# EAGLE design Graka (EAGLE 4.09)
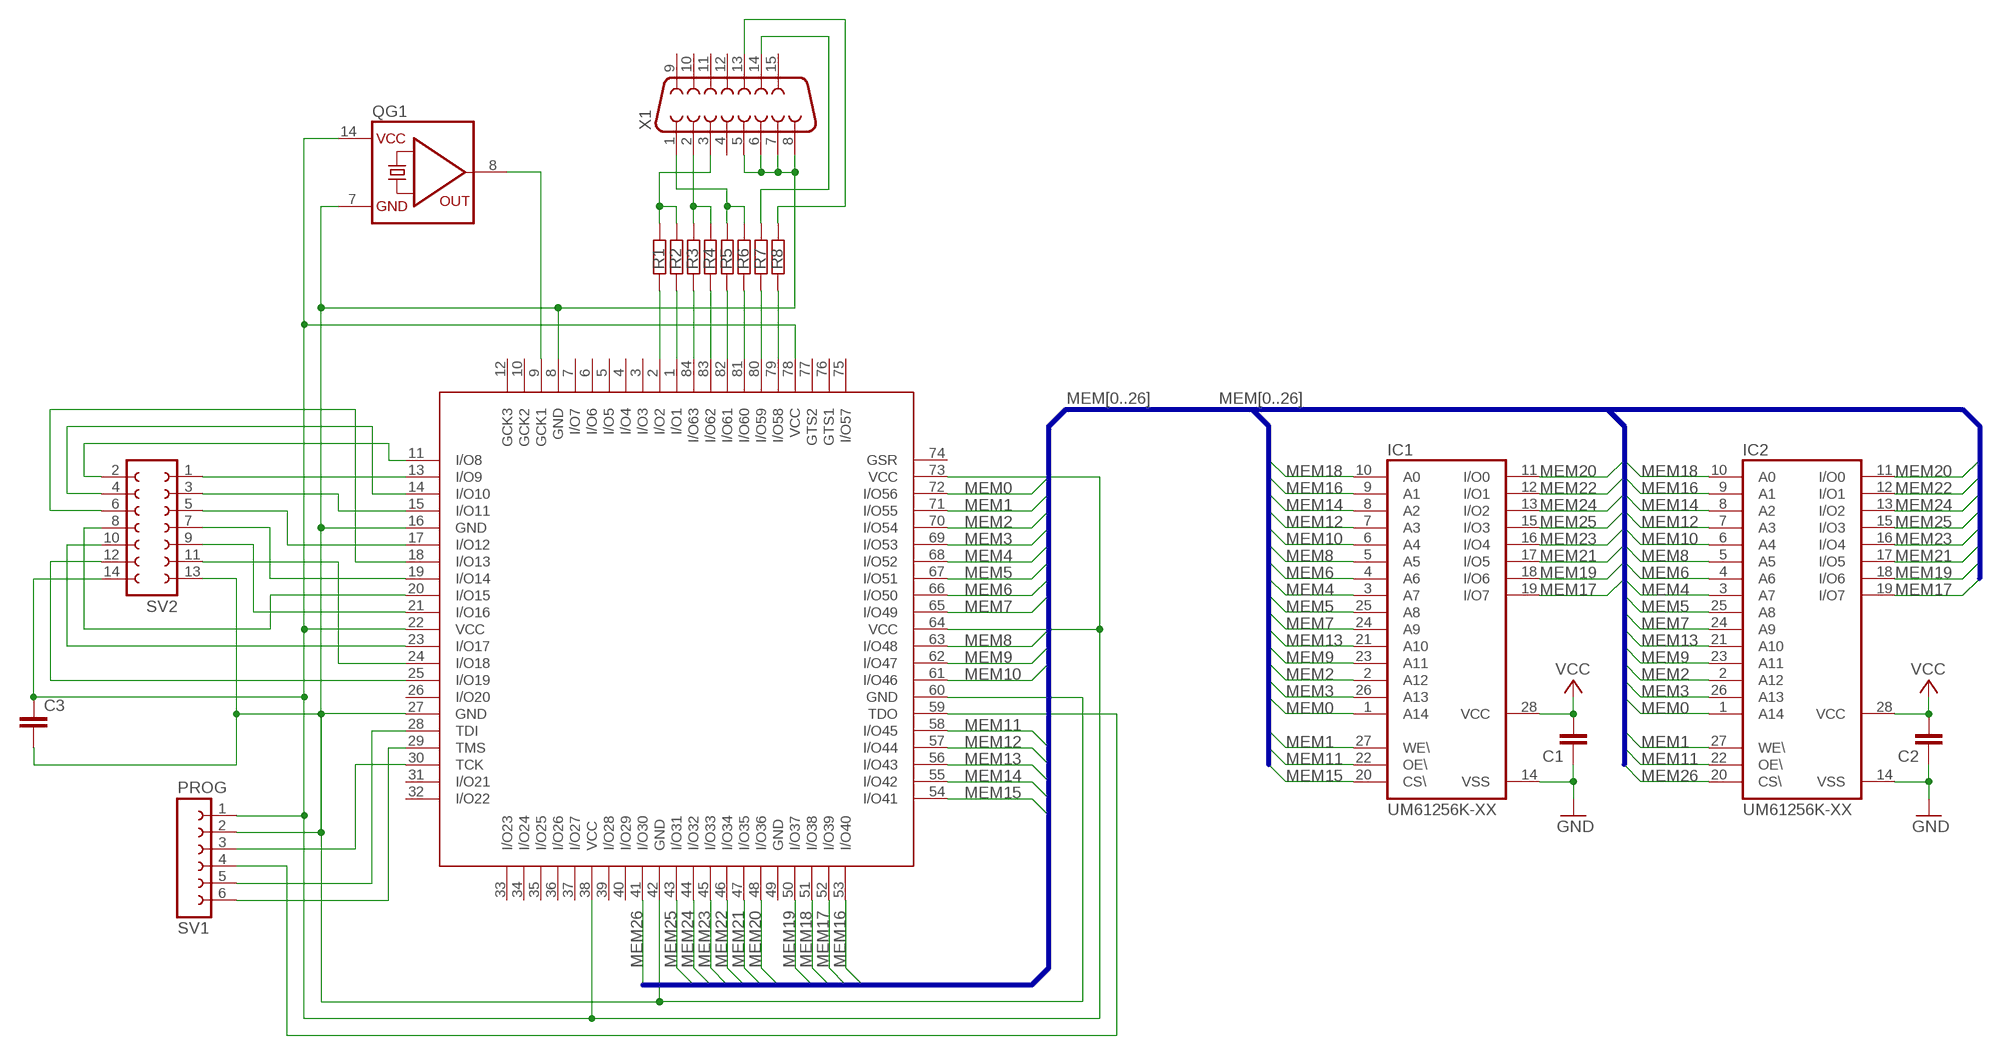
[diagram p0: schematic, sheet 1]

## Parts
C1  C-EU050-025X075  [C050-025X075]
C2  C-EU050-025X075  [C050-025X075]
C3  C-EU050-025X075  [C050-025X075]
IC1  UM61256K-XX  [DIP28_3]
IC2  UM61256K-XX  [DIP28_3]
QG1  QG5860  [DIL14S]
R1  R-EU_0207/10  [0207/10]
R2  R-EU_0207/10  [0207/10]
R3  R-EU_0207/10  [0207/10]
R4  R-EU_0207/10  [0207/10]
R5  R-EU_0207/10  [0207/10]
R6  R-EU_0207/10  [0207/10]
R7  R-EU_0207/10  [0207/10]
R8  R-EU_0207/10  [0207/10]
SV1  PROG  FE06-1  [FE06]
SV2  FE07-2  [FE07-2]
X1  F15HDH  [HDF15H]
XC9572  XC9572PC84  [PLCCS84]

## Nets
GND: C1.1 C2.1 C3.2 IC1.14(VSS) IC2.14(VSS) QG1.7(GND) SV1.2 SV2.13 X1.5 X1.6 X1.7 X1.8 XC9572.8(GND) XC9572.16(GND) XC9572.27(GND) XC9572.42(GND) XC9572.60(GND)
MEM0: IC1.1(A14) IC2.1(A14) XC9572.72(I/O56)
MEM1: IC1.27(WE\) IC2.27(WE\) XC9572.71(I/O55)
MEM2: IC1.2(A12) IC2.2(A12) XC9572.70(I/O54)
MEM3: IC1.26(A13) IC2.26(A13) XC9572.69(I/O53)
MEM4: IC1.3(A7) IC2.3(A7) XC9572.68(I/O52)
MEM5: IC1.25(A8) IC2.25(A8) XC9572.67(I/O51)
MEM6: IC1.4(A6) IC2.4(A6) XC9572.66(I/O50)
MEM7: IC1.24(A9) IC2.24(A9) XC9572.65(I/O49)
MEM8: IC1.5(A5) IC2.5(A5) XC9572.63(I/O48)
MEM9: IC1.23(A11) IC2.23(A11) XC9572.62(I/O47)
MEM10: IC1.6(A4) IC2.6(A4) XC9572.61(I/O46)
MEM11: IC1.22(OE\) IC2.22(OE\) XC9572.58(I/O45)
MEM12: IC1.7(A3) IC2.7(A3) XC9572.57(I/O44)
MEM13: IC1.21(A10) IC2.21(A10) XC9572.56(I/O43)
MEM14: IC1.8(A2) IC2.8(A2) XC9572.55(I/O42)
MEM15: IC1.20(CS\) XC9572.54(I/O41)
MEM16: IC1.9(A1) IC2.9(A1) XC9572.53(I/O40)
MEM17: IC1.19(I/O7) IC2.19(I/O7) XC9572.52(I/O39)
MEM18: IC1.10(A0) IC2.10(A0) XC9572.51(I/O38)
MEM19: IC1.18(I/O6) IC2.18(I/O6) XC9572.50(I/O37)
MEM20: IC1.11(I/O0) IC2.11(I/O0) XC9572.48(I/O36)
MEM21: IC1.17(I/O5) IC2.17(I/O5) XC9572.47(I/O35)
MEM22: IC1.12(I/O1) IC2.12(I/O1) XC9572.46(I/O34)
MEM23: IC1.16(I/O4) IC2.16(I/O4) XC9572.45(I/O33)
MEM24: IC1.13(I/O2) IC2.13(I/O2) XC9572.44(I/O32)
MEM25: IC1.15(I/O3) IC2.15(I/O3) XC9572.43(I/O31)
MEM26: IC2.20(CS\) XC9572.41(I/O30)
N$1: R1.1 XC9572.2(I/O2)
N$2: R2.1 XC9572.1(I/O1)
N$3: R3.1 XC9572.84(I/O63)
N$4: R4.1 XC9572.83(I/O62)
N$5: R5.1 XC9572.82(I/O61)
N$6: R6.1 XC9572.81(I/O60)
N$7: R7.1 XC9572.80(I/O59)
N$8: R8.1 XC9572.79(I/O58)
N$9: R1.2 R2.2 X1.3
N$10: R3.2 R4.2 X1.2
N$11: R5.2 R6.2 X1.1
N$12: SV1.3 XC9572.30(TCK)
N$13: SV1.4 XC9572.59(TDO)
N$14: SV1.5 XC9572.28(TDI)
N$15: SV1.6 XC9572.29(TMS)
N$16: QG1.8(OUT) XC9572.9(GCK1)
N$17: R7.2 X1.14
N$18: R8.2 X1.13
N$19: SV2.2 XC9572.11(I/O8)
N$20: SV2.1 XC9572.13(I/O9)
N$21: SV2.4 XC9572.14(I/O10)
N$22: SV2.3 XC9572.15(I/O11)
N$23: SV2.5 XC9572.17(I/O12)
N$24: SV2.6 XC9572.18(I/O13)
N$25: SV2.7 XC9572.19(I/O14)
N$26: SV2.8 XC9572.20(I/O15)
N$27: SV2.9 XC9572.21(I/O16)
N$28: SV2.10 XC9572.23(I/O17)
N$29: SV2.11 XC9572.24(I/O18)
N$30: SV2.12 XC9572.25(I/O19)
VCC: C1.2 C2.2 C3.1 IC1.28(VCC) IC2.28(VCC) QG1.14(VCC) SV1.1 SV2.14 XC9572.22(VCC) XC9572.38(VCC) XC9572.64(VCC) XC9572.73(VCC) XC9572.78(VCC)
Unconnected: X1.4 X1.9 X1.10 X1.11 X1.12 X1.15 XC9572.3(I/O3) XC9572.4(I/O4) XC9572.5(I/O5) XC9572.6(I/O6) XC9572.7(I/O7) XC9572.10(GCK2) XC9572.12(GCK3) XC9572.26(I/O20) XC9572.31(I/O21) XC9572.32(I/O22) XC9572.33(I/O23) XC9572.34(I/O24) XC9572.35(I/O25) XC9572.36(I/O26) XC9572.37(I/O27) XC9572.39(I/O28) XC9572.40(I/O29) XC9572.49(GND) XC9572.74(GSR) XC9572.75(I/O57) XC9572.76(GTS1) XC9572.77(GTS2)

## Buses
MEM[0..26]

## Library data of the parts
C1-C3 = rcl:C-EU: CAPACITOR, European symbol
IC1 IC2 = Cach-SRAM:UM61256K-XX
QG1 = crystal:QG5860: CRYSTAL RESONATOR
R1-R8 = rcl:R-EU_: RESISTOR, European symbol
SV1 = con-lsta:FE06-1: FEMALE HEADER
SV2 = con-lsta:FE07-2: FEMALE HEADER
X1 = con-subd:F15: SUB-D
XC9572 = xilinx:XC9572PC84: Xilinx CPLD 72 Cells 1600 Gates

## Board
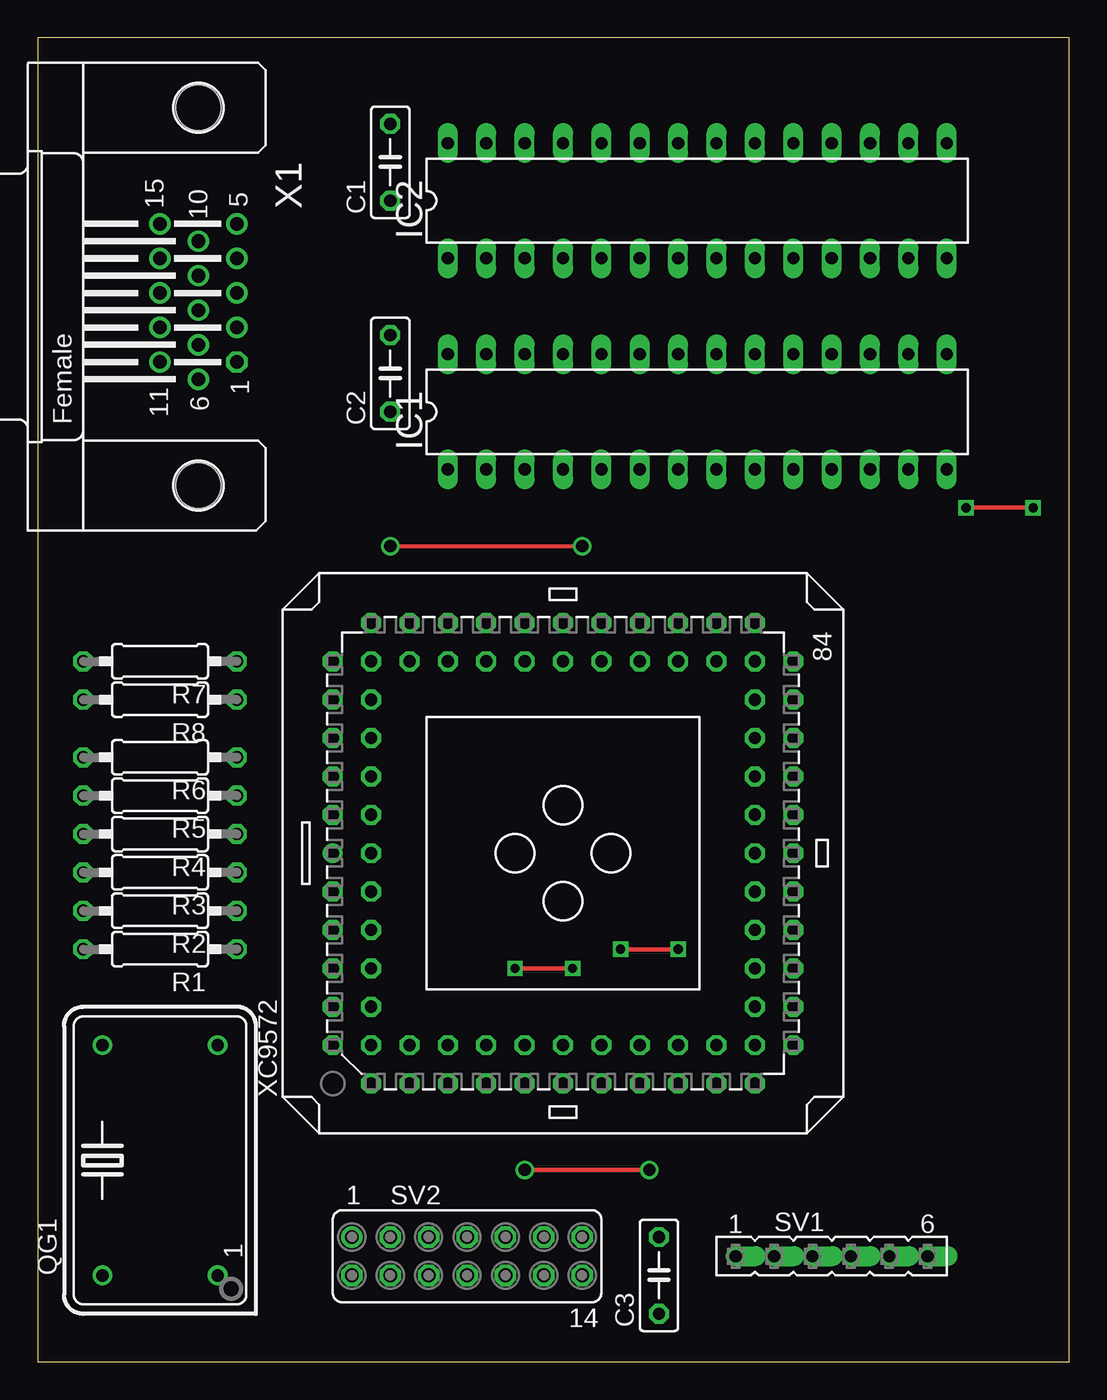
[diagram p1: board, top side]
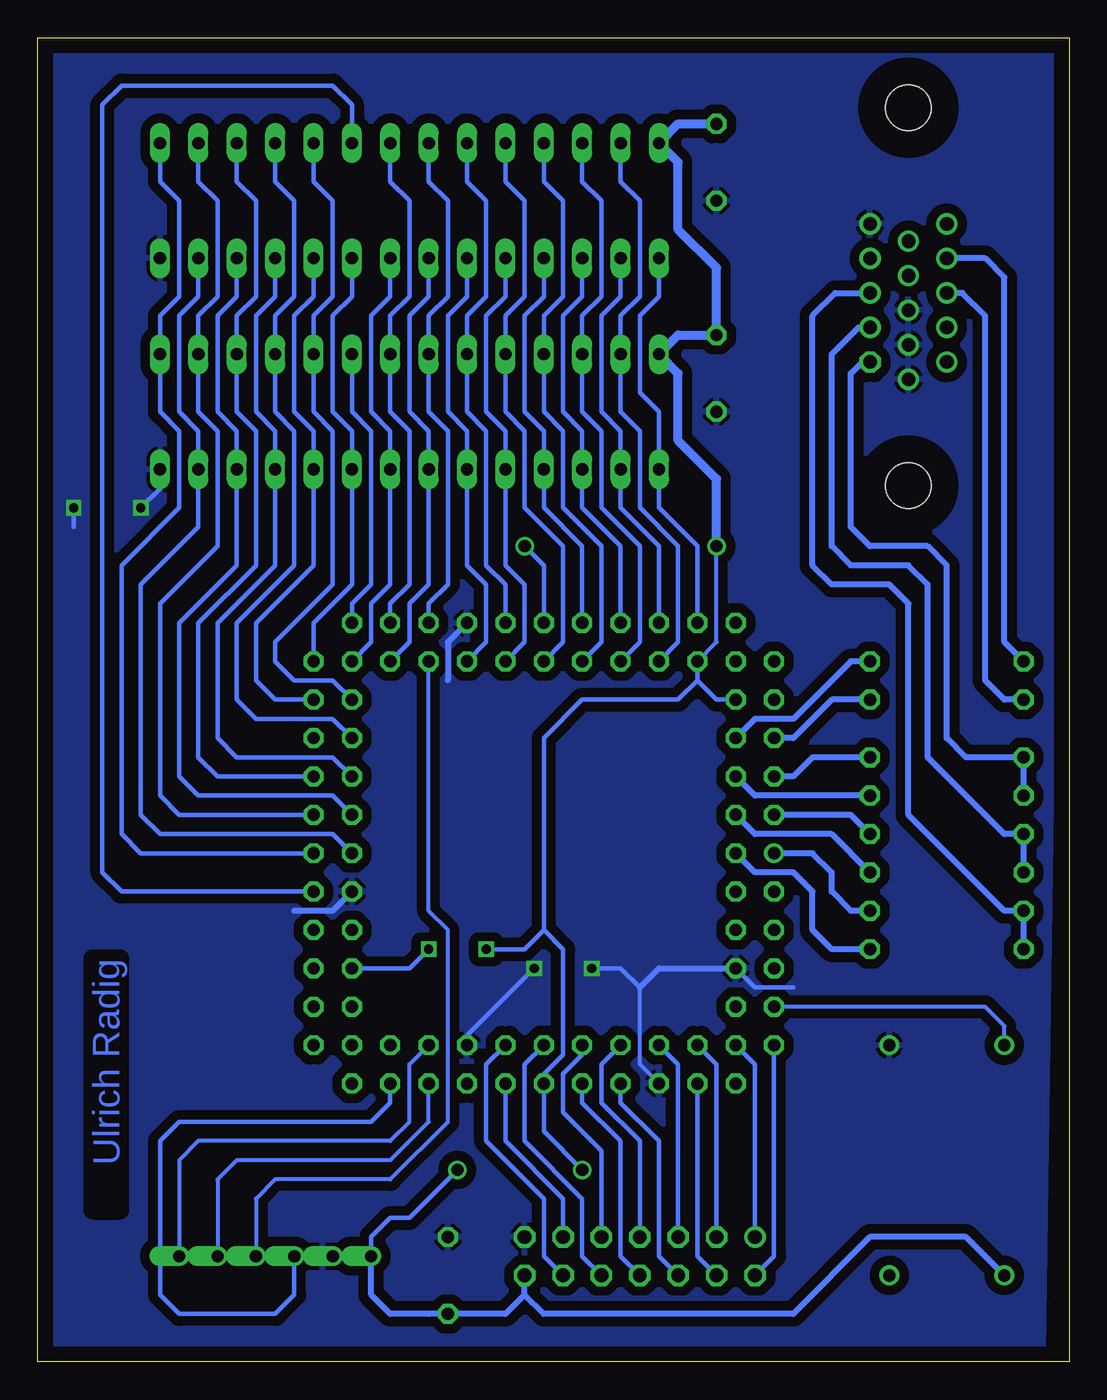
[diagram p2: board, bottom side, seen from below]

Size 68.25 x 87.61 mm. Coordinates in mm from the lower left corner, seen from the top.
Outline: 68.25,0 68.25,87.61 0,87.61 0,0 68.25,0
Copper layers used: Top, Bottom

### Footprints (pad centres in the part's own frame; a part is rotated, then mirrored left to right if it is on the bottom)
C050-025X075 = drill 0.813 octagon: 1 -2.54,0; 2 2.54,0
DIP28_3 = drill 0.813 long: 1 -3.81,16.51; 2 -3.81,13.97; 3 -3.81,11.43; 4 -3.81,8.89; 5 -3.81,6.35; 6 -3.81,3.81; 7 -3.81,1.27; 8 -3.81,-1.27; 9 -3.81,-3.81; 10 -3.81,-6.35; 11 -3.81,-8.89; 12 -3.81,-11.43; 13 -3.81,-13.97; 14 -3.81,-16.51; 15 3.81,-16.51; 16 3.81,-13.97; 17 3.81,-11.43; 18 3.81,-8.89; 19 3.81,-6.35; 20 3.81,-3.81; 21 3.81,-1.27; 22 3.81,1.27; 23 3.81,3.81; 24 3.81,6.35; 25 3.81,8.89; 26 3.81,11.43; 27 3.81,13.97; 28 3.81,16.51
DIL14S = drill 0.813 round: 1 -7.62,-3.81; 7 7.62,-3.81; 8 7.62,3.81; 14 -7.62,3.81
0207/10 = drill 0.813 octagon: 1 -5.08,0; 2 5.08,0
FE06 = drill 0.813 offset: 1 -6.35,0; 2 -3.81,0; 3 -1.27,0; 4 1.27,0; 5 3.81,0; 6 6.35,0
FE07-2 = drill 0.914 round: 1 -7.62,1.27 | drill 0.914 octagon: 2 -7.62,-1.27; 3 -5.08,1.27; 4 -5.08,-1.27; 5 -2.54,1.27; 6 -2.54,-1.27; 7 0,1.27; 8 0,-1.27; 9 2.54,1.27; 10 2.54,-1.27; 11 5.08,1.27; 12 5.08,-1.27; 13 7.62,1.27; 14 7.62,-1.27
HDF15H = drill 0.9 octagon: 1 4.329,2.54 | drill 0.9 round: 2 2.043,2.54; 3 -0.243,2.54; 4 -2.529,2.54; 5 -4.815,2.54; 6 5.472,0; 7 3.186,0; 8 0.9,0; 9 -1.386,0; 10 -3.672,0; 11 4.329,-2.54; 12 2.043,-2.54; 13 -0.243,-2.54; 14 -2.529,-2.54; 15 -4.815,-2.54 | hole 3: -12.5,0; 12.5,0
PLCCS84 = drill 0.813 round: 1 0,13.97 | drill 0.813 octagon: 2 0,11.43; 3 -2.54,13.97; 4 -2.54,11.43; 5 -5.08,13.97; 6 -5.08,11.43; 7 -7.62,13.97; 8 -7.62,11.43; 9 -10.16,13.97; 10 -10.16,11.43; 11 -12.7,13.97; 12 -15.24,11.43; 13 -12.7,11.43; 14 -15.24,8.89; 15 -12.7,8.89; 16 -15.24,6.35; 17 -12.7,6.35; 18 -15.24,3.81; 19 -12.7,3.81; 20 -15.24,1.27; 21 -12.7,1.27; 22 -15.24,-1.27; 23 -12.7,-1.27; 24 -15.24,-3.81; 25 -12.7,-3.81; 26 -15.24,-6.35; 27 -12.7,-6.35; 28 -15.24,-8.89; 29 -12.7,-8.89; 30 -15.24,-11.43; 31 -12.7,-11.43; 32 -15.24,-13.97; 33 -12.7,-16.51; 34 -12.7,-13.97; 35 -10.16,-16.51; 36 -10.16,-13.97; 37 -7.62,-16.51; 38 -7.62,-13.97; 39 -5.08,-16.51; 40 -5.08,-13.97; 41 -2.54,-16.51; 42 -2.54,-13.97; 43 0,-16.51; 44 0,-13.97; 45 2.54,-16.51; 46 2.54,-13.97; 47 5.08,-16.51; 48 5.08,-13.97; 49 7.62,-16.51; 50 7.62,-13.97; 51 10.16,-16.51; 52 10.16,-13.97; 53 12.7,-16.51; 54 15.24,-13.97; 55 12.7,-13.97; 56 15.24,-11.43; 57 12.7,-11.43; 58 15.24,-8.89; 59 12.7,-8.89; 60 15.24,-6.35; 61 12.7,-6.35; 62 15.24,-3.81; 63 12.7,-3.81; 64 15.24,-1.27; 65 12.7,-1.27; 66 15.24,1.27; 67 12.7,1.27; 68 15.24,3.81; 69 12.7,3.81; 70 15.24,6.35; 71 12.7,6.35; 72 15.24,8.89; 73 12.7,8.89; 74 15.24,11.43; 75 12.7,13.97; 76 12.7,11.43; 77 10.16,13.97; 78 10.16,11.43; 79 7.62,13.97; 80 7.62,11.43; 81 5.08,13.97; 82 5.08,11.43; 83 2.54,13.97; 84 2.54,11.43

### Placement (x,y rotation side)
C1  23.33,79.37 90 top
C2  23.33,65.4 90 top
C3  41.11,5.71 90 top
IC1  43.65,62.86 90 top
IC2  43.65,76.83 90 top
QG1  8.09,13.33 90 top
R1  8.09,27.3 180 top
R2  8.09,29.84 180 top
R3  8.09,32.38 180 top
R4  8.09,34.92 180 top
R5  8.09,37.46 180 top
R6  8.09,40 180 top
R7  8.09,46.35 180 top
R8  8.09,43.81 180 top
SV1  52.54,6.98 0 top
SV2  28.41,6.98 0 top
X1  10.63,70.48 270 top
XC9572  33.49,33.65 90 top

### Tracks (layer width: path | path; a pad name or v marks a point on that pad's centre or on a via)
GND  (via drill 0.61)
  Top 0.305: v61.43,56.51 v65.88,56.51 | v31.59,26.03 v35.4,26.03
  Bottom 0.254: XC9572.16 28.41,19.68 28.41,24.76
  Bottom 0.305: IC1.14 60.16,57.78 v61.43,56.51 | v65.88,56.51 65.88,55.24 | XC9572.8 20.79,24.76 18.25,24.76 | XC9572.27 39.84,21.59 v35.4,26.03 | v31.59,26.03 29.68,26.03 28.41,24.76
  Bottom 0.406: XC9572.60 41.11,47.62 41.11,45.08 | 28.41,24.76 27.14,26.03 XC9572.8 | XC9572.42 48.73,29.84 51.27,29.84
  pour Bottom (isolate 0.635): 1.74,0.63 69.05,0.63 67.78,86.99 0.47,86.99
MEM0
  Bottom 0.305: XC9572.72 24.6,53.97 27.14,56.51 IC1.1 27.14,62.86 28.41,64.13 28.41,69.21 27.14,70.48 IC2.1
MEM1
  Bottom 0.305: XC9572.71 25.87,47.62 25.87,53.97 28.41,56.51 28.41,61.59 29.68,62.86 IC1.27 29.68,69.21 28.41,70.48 28.41,76.83 29.68,78.1 IC2.27
MEM2
  Bottom 0.305: XC9572.70 27.14,53.97 29.68,56.51 IC1.2 29.68,61.59 30.95,62.86 30.95,69.21 29.68,70.48 IC2.2
MEM3
  Bottom 0.305: XC9572.69 28.41,47.62 28.41,53.97 30.95,56.51 30.95,61.59 32.22,62.86 IC1.26 32.22,69.21 30.95,70.48 30.95,76.83 32.22,78.1 IC2.26
MEM4
  Bottom 0.305: XC9572.68 29.68,53.97 32.22,56.51 IC1.3 32.22,61.59 33.49,62.86 33.49,69.21 32.22,70.48 IC2.3
MEM5
  Bottom 0.305: XC9572.67 30.95,47.62 30.95,53.97 33.49,56.51 33.49,61.59 34.76,62.86 IC1.25 34.76,69.21 33.49,70.48 33.49,76.83 34.76,78.1 IC2.25
MEM6
  Bottom 0.305: XC9572.66 32.22,53.97 34.76,56.51 IC1.4 34.76,61.59 36.03,62.86 36.03,69.21 34.76,70.48 IC2.4
MEM7
  Bottom 0.305: XC9572.65 33.49,47.62 33.49,53.97 36.03,56.51 36.03,61.59 37.3,62.86 IC1.24 37.3,69.21 36.03,70.48 36.03,76.83 37.3,78.1 IC2.24
MEM8
  Bottom 0.305: XC9572.63 36.03,47.62 36.03,51.43 37.3,52.7 IC1.5 37.3,61.59 38.57,62.86 38.57,69.21 37.3,70.48 IC2.5
MEM9
  Bottom 0.305: XC9572.62 37.3,51.43 38.57,52.7 38.57,61.59 39.84,62.86 IC1.23 39.84,69.21 38.57,70.48 38.57,76.83 39.84,78.1 IC2.23
MEM10
  Bottom 0.305: XC9572.61 38.57,47.62 38.57,51.43 39.84,52.7 IC1.6 39.84,61.59 41.11,62.86 41.11,69.21 39.84,70.48 IC2.6
MEM11
  Bottom 0.305: XC9572.58 42.38,50.16 41.11,51.43 41.11,61.59 42.38,62.86 IC1.22 42.38,69.21 41.11,70.48 41.11,76.83 42.38,78.1 IC2.22
MEM12
  Bottom 0.305: XC9572.57 43.65,47.62 43.65,50.16 42.38,51.43 IC1.7 42.38,61.59 43.65,62.86 43.65,69.21 42.38,70.48 IC2.7
MEM13
  Bottom 0.305: XC9572.56 44.92,50.16 43.65,51.43 43.65,61.59 44.92,62.86 IC1.21 44.92,69.21 43.65,70.48 43.65,76.83 44.92,78.1 IC2.21
MEM14
  Bottom 0.305: XC9572.55 46.19,47.62 46.19,50.16 44.92,51.43 IC1.8 44.92,61.59 46.19,62.86 46.19,69.21 44.92,70.48 IC2.8
MEM15
  Bottom 0.305: XC9572.54 47.46,50.16 46.19,51.43 46.19,61.59 47.46,62.86 IC1.20
MEM16
  Bottom 0.305: XC9572.53 50,48.89 47.46,51.43 IC1.9 47.46,61.59 48.73,62.86 48.73,69.21 47.46,70.48 IC2.9
MEM17
  Bottom 0.305: XC9572.52 48.73,45.08 51.27,45.08 52.54,46.35 52.54,47.62 48.73,51.43 48.73,61.59 50,62.86 IC1.19 50,69.21 48.73,70.48 48.73,76.83 50,78.1 IC2.19
MEM18
  Bottom 0.305: XC9572.51 52.54,43.81 53.81,45.08 53.81,48.89 50,52.7 IC1.10 50,61.59 51.27,62.86 51.27,69.21 50,70.48 IC2.10
MEM19
  Bottom 0.305: XC9572.50 48.73,42.54 53.81,42.54 55.08,43.81 55.08,48.89 51.27,52.7 51.27,61.59 52.54,62.86 IC1.18 52.54,69.21 51.27,70.48 51.27,76.83 52.54,78.1 IC2.18
MEM20
  Bottom 0.305: XC9572.48 48.73,40 55.08,40 56.35,41.27 56.35,48.89 52.54,52.7 IC1.11 52.54,61.59 53.81,62.86 53.81,69.21 52.54,70.48 IC2.11
MEM21
  Bottom 0.305: XC9572.47 56.35,38.73 57.62,40 57.62,48.89 53.81,52.7 53.81,61.59 55.08,62.86 IC1.17 55.08,69.21 53.81,70.48 53.81,76.83 55.08,78.1 IC2.17
MEM22
  Bottom 0.305: XC9572.46 48.73,37.46 57.62,37.46 58.89,38.73 58.89,48.89 55.08,52.7 IC1.12 55.08,61.59 56.35,62.86 56.35,69.21 55.08,70.48 IC2.12
MEM23
  Bottom 0.305: XC9572.45 58.89,36.19 60.16,37.46 60.16,50.16 56.35,53.97 56.35,61.59 57.62,62.86 IC1.16 57.62,69.21 56.35,70.48 56.35,76.83 57.62,78.1 IC2.16
MEM24
  Bottom 0.305: XC9572.44 48.73,34.92 60.16,34.92 61.43,36.19 61.43,51.43 57.62,55.24 IC1.13 57.62,61.59 58.89,62.86 58.89,69.21 57.62,70.48 IC2.13
MEM25
  Bottom 0.305: XC9572.43 61.43,33.65 62.7,34.92 62.7,52.7 58.89,56.51 58.89,61.59 60.16,62.86 IC1.15 60.16,69.21 58.89,70.48 58.89,76.83 60.16,78.1 IC2.15
MEM26
  Bottom 0.305: XC9572.41 62.7,31.11 63.97,32.38 63.97,83.18 62.7,84.45 48.73,84.45 47.46,83.18 IC2.20
N$1
  Bottom 0.406: XC9572.2 20.79,32.38 18.25,32.38 16.98,31.11 16.98,28.57 15.71,27.3 R1.1
N$2
  Bottom 0.406: XC9572.1 16.98,33.65 15.71,32.38 15.71,31.11 14.44,29.84 R2.1
N$3
  Bottom 0.406: XC9572.84 20.79,34.92 15.71,34.92 R3.1
N$4
  Bottom 0.406: XC9572.83 14.44,36.19 R4.1
N$5
  Bottom 0.406: XC9572.82 20.79,37.46 R5.1
N$6
  Bottom 0.406: XC9572.81 18.25,38.73 16.98,40 R6.1
N$7
  Bottom 0.406: XC9572.80 20.79,42.54 18.25,42.54 14.44,46.35 R7.1
N$8
  Bottom 0.406: XC9572.79 18.25,41.27 15.71,43.81 R8.1
N$9
  Bottom 0.406: R1.2 R2.2 4.28,29.84 10.63,36.19 10.63,50.16 11.9,51.43 15.71,51.43 16.98,52.7 16.98,69.21 15.47,70.72 X1.3
N$10
  Bottom 0.406: R3.2 R4.2 4.28,34.92 9.36,40 9.36,51.43 10.63,52.7 14.44,52.7 15.71,53.97 15.71,66.67 13.94,68.44 X1.2
N$11
  Bottom 0.406: R5.2 R6.2 6.82,40 8.09,41.27 8.09,52.7 9.36,53.97 13.17,53.97 14.44,55.24 14.44,65.4 13.69,66.15 X1.1
N$12
  Bottom 0.305: XC9572.30 44.92,17.14 46.19,15.87 58.89,15.87 60.16,14.6 60.16,4.44 58.89,3.17 52.54,3.17 51.27,4.44 SV1.3
N$13
  Bottom 0.254: XC9572.59 42.38,29.84 41.11,28.57 41.11,15.87 44.92,12.06 52.54,12.06 53.81,10.79 SV1.4
N$14
  Bottom 0.254: XC9572.28 42.38,15.87 44.92,13.33 55.08,13.33 56.35,12.06 SV1.5
N$15
  Bottom 0.254: XC9572.29 43.65,19.68 43.65,15.87 44.92,14.6 57.62,14.6 58.89,13.33 SV1.6
N$16
  Bottom 0.254: QG1.8 4.28,22.22 5.55,23.49 XC9572.9
N$17
  Bottom 0.406: R7.2 4.28,47.62 4.28,71.75 5.55,73.02 X1.14
N$18
  Bottom 0.406: R8.2 4.28,43.81 5.55,45.08 5.55,69.21 7.06,70.72 X1.13
N$19
  Bottom 0.305: XC9572.11 19.52,6.98 SV2.2
N$20
  Bottom 0.305: XC9572.13 20.79,19.68 SV2.1
N$21
  Bottom 0.305: XC9572.14 24.6,6.98 SV2.4
N$22
  Bottom 0.305: SV2.3 23.33,19.68 XC9572.15
N$23
  Bottom 0.305: XC9572.17 25.87,19.68 SV2.5
N$24
  Bottom 0.305: XC9572.18 29.68,17.14 27.14,14.6 27.14,6.98 SV2.6
N$25
  Bottom 0.305: XC9572.19 30.95,19.68 30.95,17.14 28.41,14.6 SV2.7
N$26
  Bottom 0.305: XC9572.20 32.22,17.14 29.68,14.6 29.68,6.98 SV2.8
N$27
  Bottom 0.305: SV2.9 30.95,13.96 33.49,16.5 33.49,19.04 32.22,20.31 XC9572.21
N$28
  Bottom 0.305: XC9572.23 36.03,19.68 36.03,14.6 32.22,10.79 32.22,6.98 SV2.10
N$29
  Bottom 0.305: SV2.11 33.49,10.79 37.3,14.6 XC9572.24
N$30
  Bottom 0.305: SV2.12 34.76,6.98 34.76,10.79 38.57,14.6 38.57,19.68 XC9572.25
VCC  (via drill 0.61, 0.81)
  Top 0.254: v23.33,53.97 v36.03,53.97
  Top 0.305: v38.57,27.3 v42.38,27.3 | v40.48,12.7 v32.22,12.7
  Bottom 0.254: XC9572.73 23.33,47.62 v23.33,53.97
  Bottom 0.305: XC9572.64 34.76,52.7 v36.03,53.97 | 24.6,45.08 XC9572.73 | 24.6,45.08 23.33,43.81 XC9572.78 | XC9572.38 43.65,26.03 v42.38,27.3 | v38.57,27.3 36.03,27.3 34.76,28.57 | 34.76,28.57 34.76,41.27 32.22,43.81 25.87,43.81 24.6,45.08 | v32.22,12.7 34.76,15.23 XC9572.22 34.76,19.04 33.49,20.31 33.49,27.3 34.76,28.57 | v40.48,12.7 43.65,9.52 44.92,9.52 46.19,8.25 SV1.1
  Bottom 0.406: QG1.14 6.82,8.25 13.17,8.25 18.25,3.17 34.76,3.17 36.03,4.44 | 36.03,4.44 SV2.14 | 36.03,4.44 37.3,3.17 C3.1 42.38,3.17 44.92,3.17 46.19,4.44 SV1.1
  Bottom 0.61: v23.33,53.97 23.33,58.41 25.87,60.95 25.87,65.4 IC1.28 25.87,67.94 C2.2 23.33,72.39 25.87,74.92 25.87,79.37 IC2.28 25.87,81.91 C1.2

### Text on the board
Bottom: Ulrich Radig